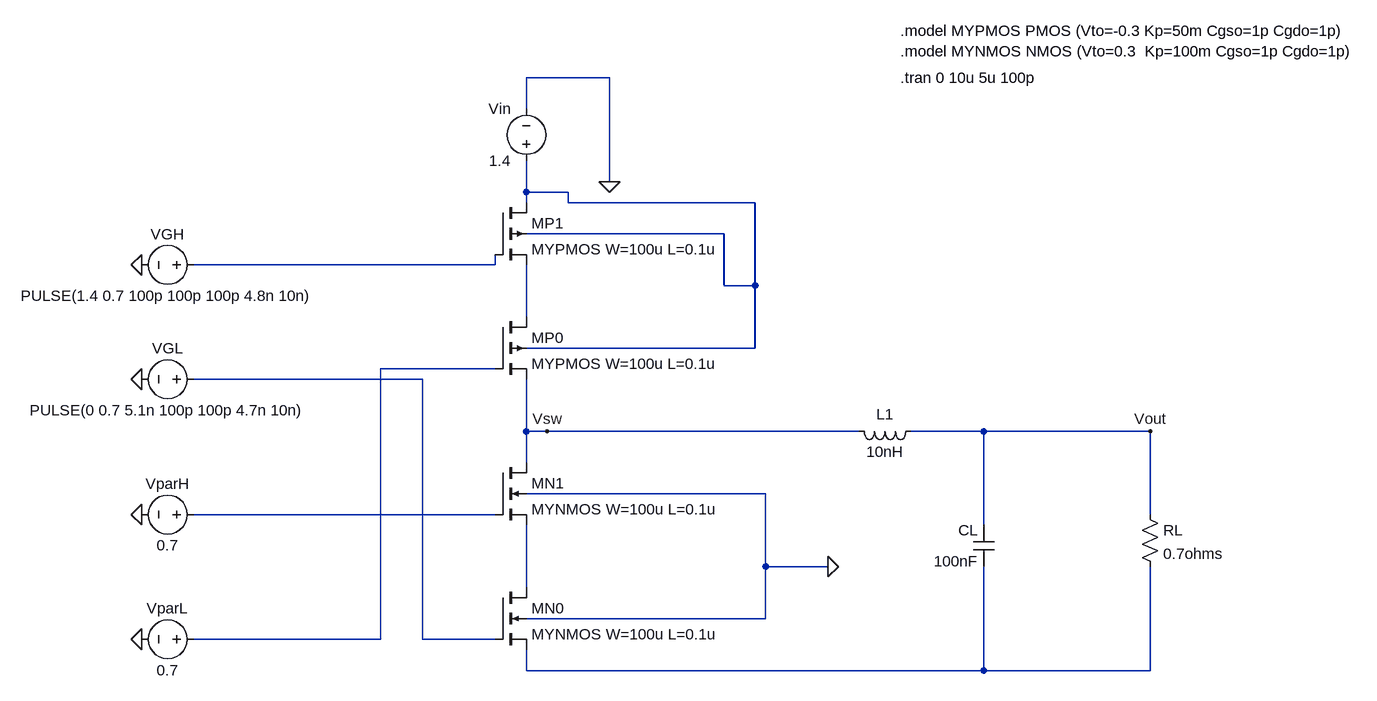
[diagram p0: schematic BuckConverter.asc]
BuckConverter.asc, the LTspice schematic file:
Version 4.1
SHEET 1 1480 896
WIRE 288 -32 160 -32
WIRE 160 16 160 -32
WIRE 288 128 288 -32
WIRE 160 144 160 96
WIRE 224 144 160 144
WIRE 160 160 160 144
WIRE 224 160 224 144
WIRE 512 160 224 160
WIRE 464 208 160 208
WIRE 112 256 112 240
WIRE 112 256 -352 256
WIRE 464 288 464 208
WIRE 512 288 512 160
WIRE 512 288 464 288
WIRE 160 336 160 256
WIRE 512 384 512 288
WIRE 512 384 160 384
WIRE 112 416 -64 416
WIRE 0 432 -352 432
WIRE 160 512 160 432
WIRE 192 512 160 512
WIRE 672 512 192 512
WIRE 864 512 752 512
WIRE 1120 512 864 512
WIRE 160 560 160 512
WIRE 528 608 160 608
WIRE 112 640 -352 640
WIRE 1120 640 1120 512
WIRE 864 656 864 512
WIRE 528 720 528 608
WIRE 624 720 528 720
WIRE 160 752 160 656
WIRE 528 800 528 720
WIRE 528 800 160 800
WIRE -64 832 -64 416
WIRE -64 832 -352 832
WIRE 0 832 0 432
WIRE 112 832 0 832
WIRE 160 880 160 848
WIRE 864 880 864 720
WIRE 864 880 160 880
WIRE 1120 880 1120 720
WIRE 1120 880 864 880
FLAG 192 512 Vsw
FLAG 1120 512 Vout
FLAG 288 128 0
FLAG -432 256 0
FLAG -432 432 0
FLAG -432 640 0
FLAG -432 832 0
FLAG 624 720 0
SYMBOL voltage 160 112 R180
WINDOW 0 24 96 Left 2
WINDOW 3 24 16 Left 2
WINDOW 123 0 0 Left 0
WINDOW 39 0 0 Left 0
SYMATTR InstName Vin
SYMATTR Value 1.4
SYMBOL voltage -336 256 R90
WINDOW 0 -32 56 VBottom 2
WINDOW 3 32 56 VTop 2
WINDOW 123 0 0 Left 0
WINDOW 39 0 0 Left 0
SYMATTR InstName VGH
SYMATTR Value PULSE(1.4 0.7 100p 100p 100p 4.8n 10n)
SYMBOL voltage -336 432 R90
WINDOW 0 -32 56 VBottom 2
WINDOW 3 32 56 VTop 2
WINDOW 123 0 0 Left 0
WINDOW 39 0 0 Left 0
SYMATTR InstName VGL
SYMATTR Value PULSE(0 0.7 5.1n 100p 100p 4.7n 10n)
SYMBOL voltage -336 640 R90
WINDOW 0 -32 56 VBottom 2
WINDOW 3 32 56 VTop 2
WINDOW 123 0 0 Left 0
WINDOW 39 0 0 Left 0
SYMATTR InstName VparH
SYMATTR Value 0.7
SYMBOL voltage -336 832 R90
WINDOW 0 -32 56 VBottom 2
WINDOW 3 32 56 VTop 2
WINDOW 123 0 0 Left 0
WINDOW 39 0 0 Left 0
SYMATTR InstName VparL
SYMATTR Value 0.7
SYMBOL pmos4 112 160 R0
SYMATTR InstName MP1
SYMATTR Value MYPMOS W=100u L=0.1u
SYMBOL pmos4 112 336 R0
SYMATTR InstName MP0
SYMATTR Value MYPMOS W=100u L=0.1u
SYMBOL nmos4 112 560 R0
SYMATTR InstName MN1
SYMATTR Value MYNMOS W=100u L=0.1u
SYMBOL nmos4 112 752 R0
SYMATTR InstName MN0
SYMATTR Value MYNMOS W=100u L=0.1u
SYMBOL cap 880 720 R180
WINDOW 0 24 56 Left 2
WINDOW 3 24 8 Left 2
SYMATTR InstName CL
SYMATTR Value 100nF
SYMBOL res 1104 624 R0
SYMATTR InstName RL
SYMATTR Value 0.7ohms
SYMBOL ind 768 496 R90
WINDOW 0 5 56 VBottom 2
WINDOW 3 32 56 VTop 2
SYMATTR InstName L1
SYMATTR Value 10nH
TEXT 736 -104 Left 2 !.model MYPMOS PMOS (Vto=-0.3 Kp=50m Cgso=1p Cgdo=1p)\n.model MYNMOS NMOS (Vto=0.3  Kp=100m Cgso=1p Cgdo=1p)
TEXT 736 -32 Left 2 !.tran 0 10u 5u 100p

The netlist it stands for:
* BuckConverter.asc
Vin N001 0 1.4
VGH N002 0 PULSE(1.4 0.7 100p 100p 100p 4.8n 10n)
VGL N005 0 PULSE(0 0.7 5.1n 100p 100p 4.7n 10n)
VparH N006 0 0.7
VparL N004 0 0.7
MP1 N001 N002 N003 N001 MYPMOS W=100u L=0.1u
MP0 N003 N004 Vsw N001 MYPMOS W=100u L=0.1u
MN1 Vsw N006 N007 0 MYNMOS W=100u L=0.1u
MN0 N007 N005 N008 0 MYNMOS W=100u L=0.1u
CL N008 Vout 100nF
RL Vout N008 0.7ohms
L1 Vout Vsw 10nH
.model NMOS NMOS
.model PMOS PMOS
.lib standard.mos
.model MYPMOS PMOS (Vto=-0.3 Kp=50m Cgso=1p Cgdo=1p)
.model MYNMOS NMOS (Vto=0.3  Kp=100m Cgso=1p Cgdo=1p)
.tran 0 10u 5u 100p
.backanno
.end